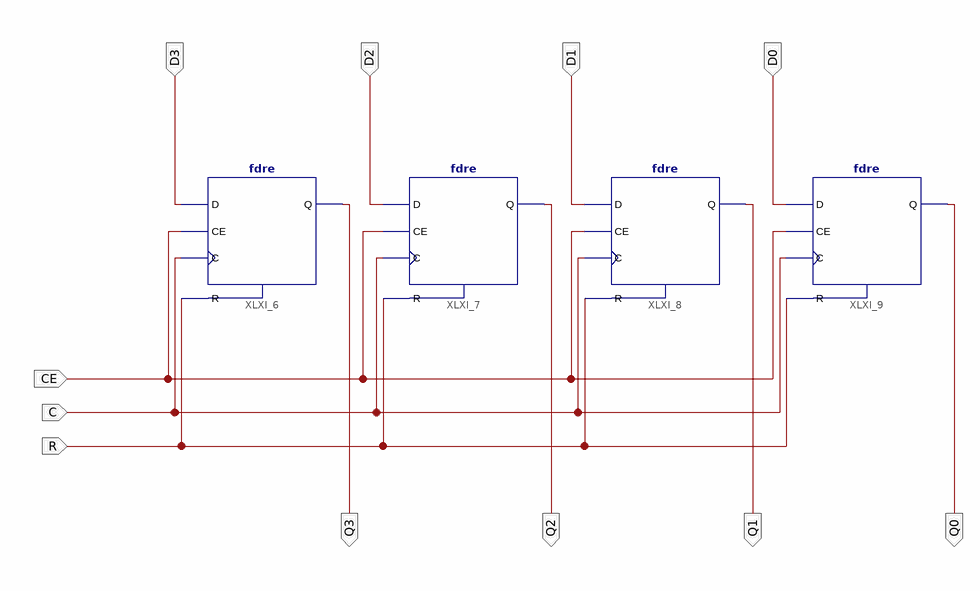
[diagram p0: schematic sheet 1]
// Xilinx ISE schematic Registers.sch (virtex6) as structural Verilog: 4 symbols, 11 ports
module Registers (
  input  CE,
  input  C,
  input  R,
  input  D1,
  input  D0,
  input  D3,
  input  D2,
  output Q1,
  output Q0,
  output Q3,
  output Q2
);

  fdre XLXI_7 (.C(C), .CE(CE), .D(D2), .R(R), .Q(Q2));
  fdre XLXI_8 (.C(C), .CE(CE), .D(D1), .R(R), .Q(Q1));
  fdre XLXI_9 (.C(C), .CE(CE), .D(D0), .R(R), .Q(Q0));
  fdre XLXI_6 (.C(C), .CE(CE), .D(D3), .R(R), .Q(Q3));
endmodule
